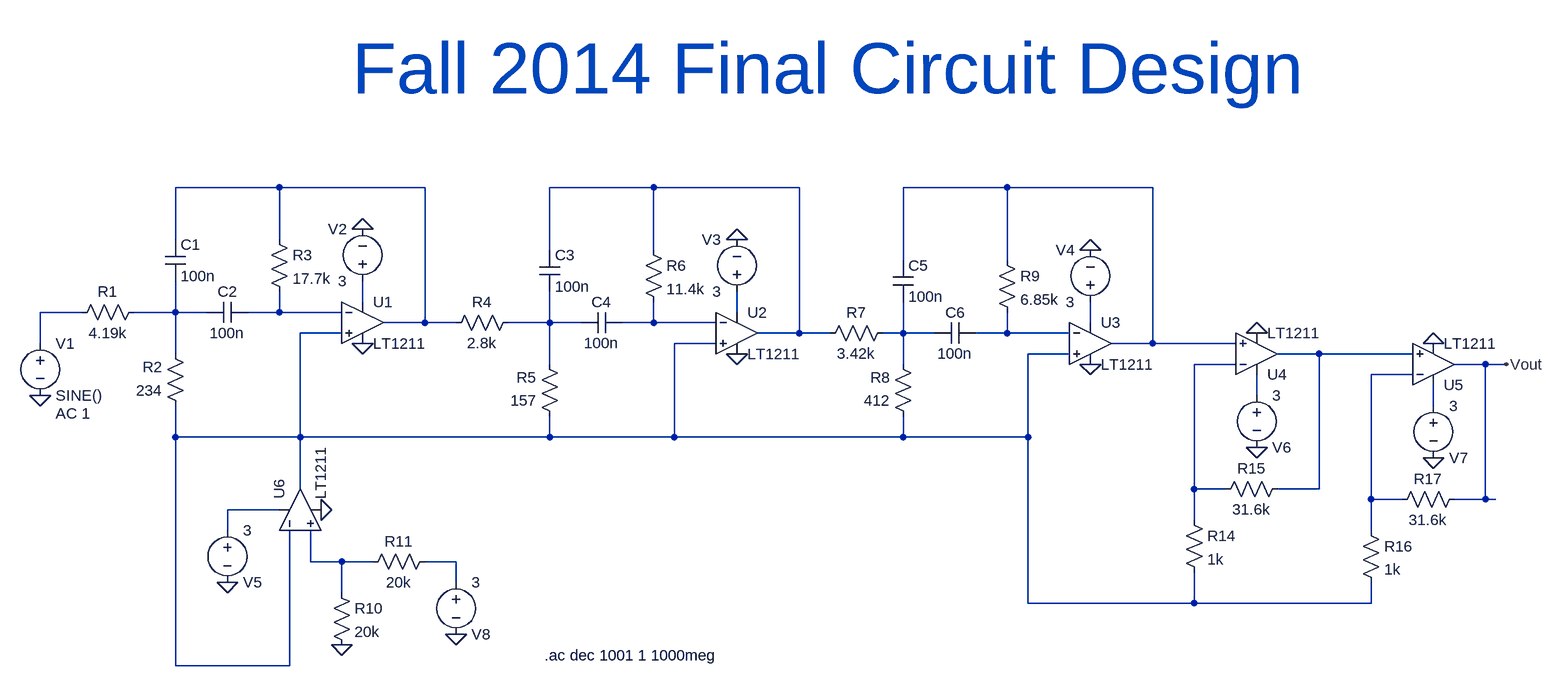
[diagram p0: schematic 2014F Amplifier Final Design.asc]
2014F Amplifier Final Design.asc, the LTspice schematic file:
Version 4
SHEET 1 2596 1092
WIRE 464 -144 304 -144
WIRE 688 -144 464 -144
WIRE 1040 -144 880 -144
WIRE 1264 -144 1040 -144
WIRE 1584 -144 1424 -144
WIRE 1808 -144 1584 -144
WIRE 304 -64 304 -144
WIRE 464 -64 464 -144
WIRE 880 -48 880 -144
WIRE 1040 -48 1040 -144
WIRE 1424 -32 1424 -144
WIRE 1584 -32 1584 -144
WIRE 592 32 592 0
WIRE 160 48 96 48
WIRE 304 48 304 0
WIRE 304 48 240 48
WIRE 352 48 304 48
WIRE 464 48 464 16
WIRE 464 48 416 48
WIRE 560 48 464 48
WIRE 1168 48 1168 16
WIRE 688 64 688 -144
WIRE 688 64 624 64
WIRE 736 64 688 64
WIRE 880 64 880 16
WIRE 880 64 816 64
WIRE 928 64 880 64
WIRE 1040 64 1040 32
WIRE 1040 64 992 64
WIRE 1136 64 1040 64
WIRE 1712 64 1712 32
WIRE 560 80 496 80
WIRE 1264 80 1264 -144
WIRE 1264 80 1200 80
WIRE 1312 80 1264 80
WIRE 1424 80 1424 32
WIRE 1424 80 1392 80
WIRE 1472 80 1424 80
WIRE 1584 80 1584 48
WIRE 1584 80 1536 80
WIRE 1680 80 1584 80
WIRE 96 96 96 48
WIRE 1136 96 1072 96
WIRE 1808 96 1808 -144
WIRE 1808 96 1744 96
WIRE 1936 96 1808 96
WIRE 304 112 304 48
WIRE 1680 112 1616 112
WIRE 2064 112 2000 112
WIRE 2208 112 2064 112
WIRE 880 128 880 64
WIRE 1424 128 1424 80
WIRE 1936 128 1872 128
WIRE 2320 128 2272 128
WIRE 2352 128 2320 128
WIRE 2208 144 2144 144
WIRE 1968 176 1968 144
WIRE 2240 192 2240 160
WIRE 304 240 304 192
WIRE 496 240 496 80
WIRE 496 240 304 240
WIRE 880 240 880 208
WIRE 880 240 496 240
WIRE 1072 240 1072 96
WIRE 1072 240 880 240
WIRE 1424 240 1424 208
WIRE 1424 240 1072 240
WIRE 1616 240 1616 112
WIRE 1616 240 1424 240
WIRE 496 320 496 240
WIRE 1872 320 1872 128
WIRE 1920 320 1872 320
WIRE 2064 320 2064 112
WIRE 2064 320 2000 320
WIRE 2144 336 2144 144
WIRE 2192 336 2144 336
WIRE 2320 336 2320 128
WIRE 2320 336 2272 336
WIRE 2336 336 2320 336
WIRE 464 352 384 352
WIRE 1872 368 1872 320
WIRE 384 384 384 352
WIRE 2144 384 2144 336
WIRE 512 432 512 384
WIRE 560 432 512 432
WIRE 608 432 560 432
WIRE 736 432 688 432
WIRE 736 464 736 432
WIRE 560 480 560 432
WIRE 1616 496 1616 240
WIRE 1872 496 1872 448
WIRE 1872 496 1616 496
WIRE 2144 496 2144 464
WIRE 2144 496 1872 496
WIRE 304 592 304 240
WIRE 480 592 480 384
WIRE 480 592 304 592
FLAG 96 176 0
FLAG 592 -80 0
FLAG 592 96 0
FLAG 1168 -64 0
FLAG 1168 112 0
FLAG 1712 -48 0
FLAG 1712 128 0
FLAG 1968 80 0
FLAG 1968 256 0
FLAG 2240 96 0
FLAG 2240 272 0
FLAG 528 352 0
FLAG 384 464 0
FLAG 736 544 0
FLAG 560 560 0
FLAG 2352 128 Vout
SYMBOL voltage 96 80 R0
WINDOW 123 24 124 Left 2
WINDOW 39 0 0 Left 2
SYMATTR Value2 AC 1
SYMATTR InstName V1
SYMATTR Value SINE()
SYMBOL res 256 32 R90
WINDOW 0 0 56 VBottom 2
WINDOW 3 32 56 VTop 2
SYMATTR InstName R1
SYMATTR Value 4.19k
SYMBOL res 320 208 R180
WINDOW 0 36 76 Left 2
WINDOW 3 36 40 Left 2
SYMATTR InstName R2
SYMATTR Value 234
SYMBOL cap 288 -64 R0
SYMATTR InstName C1
SYMATTR Value 100n
SYMBOL cap 416 32 R90
WINDOW 0 0 32 VBottom 2
WINDOW 3 32 32 VTop 2
SYMATTR InstName C2
SYMATTR Value 100n
SYMBOL res 448 -80 R0
SYMATTR InstName R3
SYMATTR Value 17.7k
SYMBOL LT1211 592 0 R0
SYMATTR InstName U1
SYMBOL res 832 48 R90
WINDOW 0 0 56 VBottom 2
WINDOW 3 32 56 VTop 2
SYMATTR InstName R4
SYMATTR Value 2.8k
SYMBOL voltage 592 16 R180
WINDOW 0 24 96 Left 2
WINDOW 3 24 16 Left 2
WINDOW 123 0 0 Left 2
WINDOW 39 0 0 Left 2
SYMATTR InstName V2
SYMATTR Value 3
SYMBOL res 896 224 R180
WINDOW 0 36 76 Left 2
WINDOW 3 36 40 Left 2
SYMATTR InstName R5
SYMATTR Value 157
SYMBOL cap 864 -48 R0
SYMATTR InstName C3
SYMATTR Value 100n
SYMBOL cap 992 48 R90
WINDOW 0 0 32 VBottom 2
WINDOW 3 32 32 VTop 2
SYMATTR InstName C4
SYMATTR Value 100n
SYMBOL res 1024 -64 R0
SYMATTR InstName R6
SYMATTR Value 11.4k
SYMBOL LT1211 1168 16 R0
SYMATTR InstName U2
SYMBOL res 1408 64 R90
WINDOW 0 0 56 VBottom 2
WINDOW 3 32 56 VTop 2
SYMATTR InstName R7
SYMATTR Value 3.42k
SYMBOL voltage 1168 32 R180
WINDOW 0 24 96 Left 2
WINDOW 3 24 16 Left 2
WINDOW 123 0 0 Left 2
WINDOW 39 0 0 Left 2
SYMATTR InstName V3
SYMATTR Value 3
SYMBOL res 1440 224 R180
WINDOW 0 36 76 Left 2
WINDOW 3 36 40 Left 2
SYMATTR InstName R8
SYMATTR Value 412
SYMBOL cap 1408 -32 R0
SYMATTR InstName C5
SYMATTR Value 100n
SYMBOL cap 1536 64 R90
WINDOW 0 0 32 VBottom 2
WINDOW 3 32 32 VTop 2
SYMATTR InstName C6
SYMATTR Value 100n
SYMBOL res 1568 -48 R0
SYMATTR InstName R9
SYMATTR Value 6.85k
SYMBOL LT1211 1712 32 R0
SYMATTR InstName U3
SYMBOL voltage 1712 48 R180
WINDOW 0 24 96 Left 2
WINDOW 3 24 16 Left 2
WINDOW 123 0 0 Left 2
WINDOW 39 0 0 Left 2
SYMATTR InstName V4
SYMATTR Value 3
SYMBOL LT1211 1968 176 M180
SYMATTR InstName U4
SYMBOL voltage 1968 160 R0
WINDOW 0 24 96 Left 2
WINDOW 3 24 16 Left 2
WINDOW 123 0 0 Left 2
WINDOW 39 0 0 Left 2
SYMATTR InstName V6
SYMATTR Value 3
SYMBOL res 1856 352 R0
SYMATTR InstName R14
SYMATTR Value 1k
SYMBOL res 2016 304 R90
WINDOW 0 0 56 VBottom 2
WINDOW 3 32 56 VTop 2
SYMATTR InstName R15
SYMATTR Value 31.6k
SYMBOL LT1211 2240 192 M180
SYMATTR InstName U5
SYMBOL voltage 2240 176 R0
WINDOW 0 24 96 Left 2
WINDOW 3 24 16 Left 2
WINDOW 123 0 0 Left 2
WINDOW 39 0 0 Left 2
SYMATTR InstName V7
SYMATTR Value 3
SYMBOL res 2128 368 R0
SYMATTR InstName R16
SYMATTR Value 1k
SYMBOL res 2288 320 R90
WINDOW 0 0 56 VBottom 2
WINDOW 3 32 56 VTop 2
SYMATTR InstName R17
SYMATTR Value 31.6k
SYMBOL LT1211 432 352 R270
SYMATTR InstName U6
SYMBOL voltage 384 368 R0
WINDOW 0 24 96 Left 2
WINDOW 3 24 16 Left 2
WINDOW 123 0 0 Left 2
WINDOW 39 0 0 Left 2
SYMATTR InstName V5
SYMATTR Value 3
SYMBOL res 544 464 R0
SYMATTR InstName R10
SYMATTR Value 20k
SYMBOL res 704 416 R90
WINDOW 0 0 56 VBottom 2
WINDOW 3 32 56 VTop 2
SYMATTR InstName R11
SYMATTR Value 20k
SYMBOL voltage 736 448 R0
WINDOW 0 24 96 Left 2
WINDOW 3 24 16 Left 2
WINDOW 123 0 0 Left 2
WINDOW 39 0 0 Left 2
SYMATTR InstName V8
SYMATTR Value 3
TEXT 872 576 Left 2 !.ac dec 1001 1 1000meg
TEXT 576 -328 Left 7 ;Fall 2014 Final Circuit Design

The netlist it stands for:
* 2014F Amplifier Final Design.asc
V1 N005 0 SINE() AC 1
R1 N006 N005 4.19k
R2 N012 N006 234
C1 N001 N006 100n
C2 N007 N006 100n
R3 N001 N007 17.7k
XU1 N012 N007 N004 0 N001 LT1211  ; pins In+ In- V+ V- OUT
R4 N009 N001 2.8k
V2 N004 0 3
R5 N012 N009 157
C3 N002 N009 100n
C4 N010 N009 100n
R6 N002 N010 11.4k
XU2 N012 N010 N008 0 N002 LT1211  ; pins In+ In- V+ V- OUT
R7 N013 N002 3.42k
V3 N008 0 3
R8 N012 N013 412
C5 N003 N013 100n
C6 N014 N013 100n
R9 N003 N014 6.85k
XU3 N012 N014 N011 0 N003 LT1211  ; pins In+ In- V+ V- OUT
V4 N011 0 3
XU4 N003 N016 N018 0 N015 LT1211  ; pins In+ In- V+ V- OUT
V6 N018 0 3
R14 N016 N012 1k
R15 N015 N016 31.6k
XU5 N015 N017 N019 0 Vout LT1211  ; pins In+ In- V+ V- OUT
V7 N019 0 3
R16 N017 N012 1k
R17 Vout N017 31.6k
XU6 N021 N012 N020 0 N012 LT1211  ; pins In+ In- V+ V- OUT
V5 N020 0 3
R10 N021 0 20k
R11 N022 N021 20k
V8 N022 0 3
.ac dec 1001 1 1000meg
* Fall 2014 Final Circuit Design
.lib LTC.lib
.backanno
.end